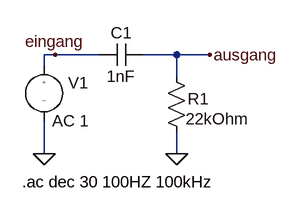
[diagram p0: schematic hochpass.asc]
hochpass.asc, the LTspice schematic file:
Version 4
SHEET 1 880 680
WIRE 16 96 0 96
WIRE 80 96 16 96
WIRE 192 96 144 96
WIRE 240 96 192 96
WIRE 0 112 0 96
WIRE 192 128 192 96
WIRE 0 240 0 192
WIRE 192 240 192 208
FLAG 192 240 0
FLAG 0 240 0
FLAG 240 96 ausgang
FLAG 16 96 eingang
SYMBOL res 176 112 R0
WINDOW 0 32 48 Left 2
WINDOW 3 29 77 Left 2
SYMATTR InstName R1
SYMATTR Value 22kOhm
SYMBOL cap 80 112 R270
WINDOW 0 32 32 VTop 2
WINDOW 3 0 32 VBottom 2
SYMATTR InstName C1
SYMATTR Value 1nF
SYMBOL source-V 0 96 R0
WINDOW 0 35 41 Left 2
WINDOW 123 12 96 Left 2
WINDOW 39 0 0 Left 2
SYMATTR InstName V1
SYMATTR Value2 AC 1
SYMATTR Value ""
TEXT -32 280 Left 2 !.ac dec 30 100HZ 100kHz

The netlist it stands for:
* hochpass.asc
R1 ausgang 0 22kOhm
C1 eingang ausgang 1nF
V1 eingang 0 AC 1
.ac dec 30 100HZ 100kHz
.backanno
.end